# Altium schematic sheet Matrice.SchDoc
size Letter; Organization: Cegep Limoilou; Address1: 1300, 8e Avenue; Address2: Québec, QC; Address3: Canada; Address4: G1J 5L5; Revision: A; SheetNumber: 3; SheetTotal: 6; Conception: Thomas Lajoie; Titre: Matrice de switches; Modification: TL
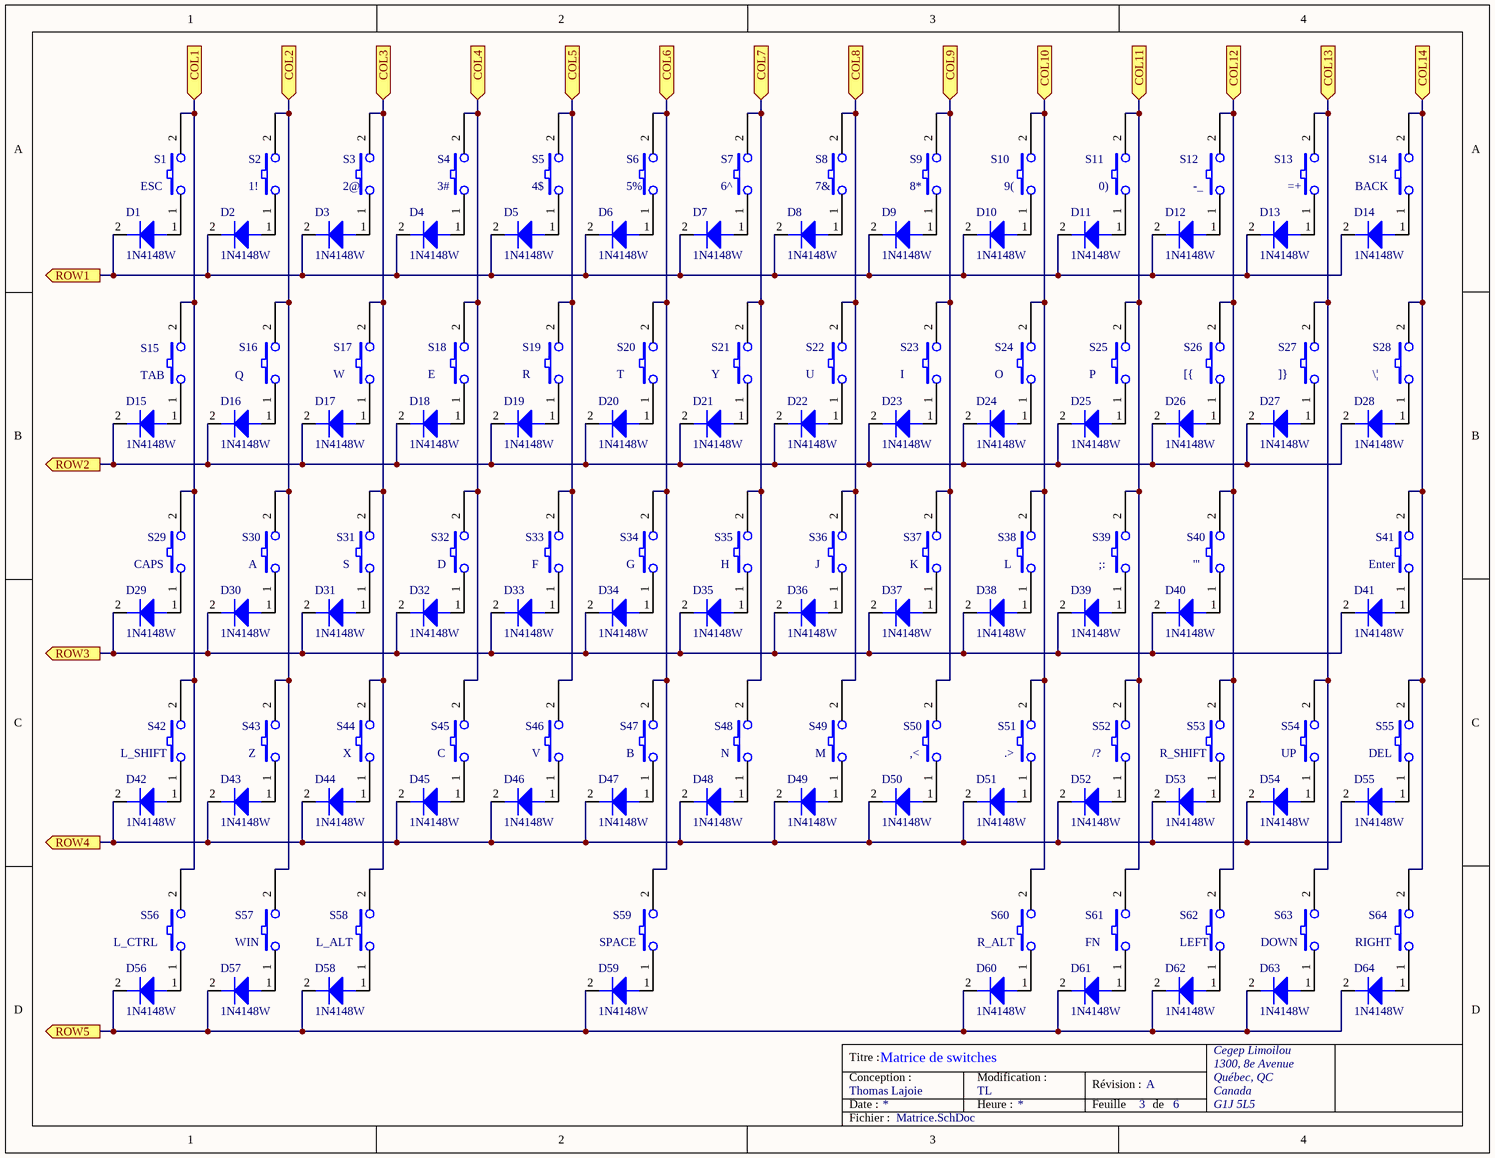
[diagram p0: Matrice.SchDoc]

## Parts
D1  1N4148W  [1N4148W(SOD123)]
D2  1N4148W  [1N4148W(SOD123)]
D3  1N4148W  [1N4148W(SOD123)]
D4  1N4148W  [1N4148W(SOD123)]
D5  1N4148W  [1N4148W(SOD123)]
D6  1N4148W  [1N4148W(SOD123)]
D7  1N4148W  [1N4148W(SOD123)]
D8  1N4148W  [1N4148W(SOD123)]
D9  1N4148W  [1N4148W(SOD123)]
D10  1N4148W  [1N4148W(SOD123)]
D11  1N4148W  [1N4148W(SOD123)]
D12  1N4148W  [1N4148W(SOD123)]
D13  1N4148W  [1N4148W(SOD123)]
D14  1N4148W  [1N4148W(SOD123)]
D15  1N4148W  [1N4148W(SOD123)]
D16  1N4148W  [1N4148W(SOD123)]
D17  1N4148W  [1N4148W(SOD123)]
D18  1N4148W  [1N4148W(SOD123)]
D19  1N4148W  [1N4148W(SOD123)]
D20  1N4148W  [1N4148W(SOD123)]
D21  1N4148W  [1N4148W(SOD123)]
D22  1N4148W  [1N4148W(SOD123)]
D23  1N4148W  [1N4148W(SOD123)]
D24  1N4148W  [1N4148W(SOD123)]
D25  1N4148W  [1N4148W(SOD123)]
D26  1N4148W  [1N4148W(SOD123)]
D27  1N4148W  [1N4148W(SOD123)]
D28  1N4148W  [1N4148W(SOD123)]
D29  1N4148W  [1N4148W(SOD123)]
D30  1N4148W  [1N4148W(SOD123)]
D31  1N4148W  [1N4148W(SOD123)]
D32  1N4148W  [1N4148W(SOD123)]
D33  1N4148W  [1N4148W(SOD123)]
D34  1N4148W  [1N4148W(SOD123)]
D35  1N4148W  [1N4148W(SOD123)]
D36  1N4148W  [1N4148W(SOD123)]
D37  1N4148W  [1N4148W(SOD123)]
D38  1N4148W  [1N4148W(SOD123)]
D39  1N4148W  [1N4148W(SOD123)]
D40  1N4148W  [1N4148W(SOD123)]
D41  1N4148W  [1N4148W(SOD123)]
D42  1N4148W  [1N4148W(SOD123)]
D43  1N4148W  [1N4148W(SOD123)]
D44  1N4148W  [1N4148W(SOD123)]
D45  1N4148W  [1N4148W(SOD123)]
D46  1N4148W  [1N4148W(SOD123)]
D47  1N4148W  [1N4148W(SOD123)]
D48  1N4148W  [1N4148W(SOD123)]
D49  1N4148W  [1N4148W(SOD123)]
D50  1N4148W  [1N4148W(SOD123)]
D51  1N4148W  [1N4148W(SOD123)]
D52  1N4148W  [1N4148W(SOD123)]
D53  1N4148W  [1N4148W(SOD123)]
D54  1N4148W  [1N4148W(SOD123)]
D55  1N4148W  [1N4148W(SOD123)]
D56  1N4148W  [1N4148W(SOD123)]
D57  1N4148W  [1N4148W(SOD123)]
D58  1N4148W  [1N4148W(SOD123)]
D59  1N4148W  [1N4148W(SOD123)]
D60  1N4148W  [1N4148W(SOD123)]
D61  1N4148W  [1N4148W(SOD123)]
D62  1N4148W  [1N4148W(SOD123)]
D63  1N4148W  [1N4148W(SOD123)]
D64  1N4148W  [1N4148W(SOD123)]
S1  ESC  [GATERON_LOWPROFILE_HOTSWAP_SOCKET]
S2  1!  [GATERON_LOWPROFILE_HOTSWAP_SOCKET]
S3  2@  [GATERON_LOWPROFILE_HOTSWAP_SOCKET]
S4  3#  [GATERON_LOWPROFILE_HOTSWAP_SOCKET]
S5  4$  [GATERON_LOWPROFILE_HOTSWAP_SOCKET]
S6  5%  [GATERON_LOWPROFILE_HOTSWAP_SOCKET]
S7  6^  [GATERON_LOWPROFILE_HOTSWAP_SOCKET]
S8  7&  [GATERON_LOWPROFILE_HOTSWAP_SOCKET]
S9  8*  [GATERON_LOWPROFILE_HOTSWAP_SOCKET]
S10  9(  [GATERON_LOWPROFILE_HOTSWAP_SOCKET]
S11  0)  [GATERON_LOWPROFILE_HOTSWAP_SOCKET]
S12  -_  [GATERON_LOWPROFILE_HOTSWAP_SOCKET]
S13  (no value)  [GATERON_LOWPROFILE_HOTSWAP_SOCKET]
S14  BACK  [GATERON_LOWPROFILE_HOTSWAP_SOCKET]
S15  TAB  [GATERON_LOWPROFILE_HOTSWAP_SOCKET]
S16  Q  [GATERON_LOWPROFILE_HOTSWAP_SOCKET]
S17  W  [GATERON_LOWPROFILE_HOTSWAP_SOCKET]
S18  E  [GATERON_LOWPROFILE_HOTSWAP_SOCKET]
S19  R  [GATERON_LOWPROFILE_HOTSWAP_SOCKET]
S20  T  [GATERON_LOWPROFILE_HOTSWAP_SOCKET]
S21  Y  [GATERON_LOWPROFILE_HOTSWAP_SOCKET]
S22  U  [GATERON_LOWPROFILE_HOTSWAP_SOCKET]
S23  I  [GATERON_LOWPROFILE_HOTSWAP_SOCKET]
S24  O  [GATERON_LOWPROFILE_HOTSWAP_SOCKET]
S25  P  [GATERON_LOWPROFILE_HOTSWAP_SOCKET]
S26  [{  [GATERON_LOWPROFILE_HOTSWAP_SOCKET]
S27  ]}  [GATERON_LOWPROFILE_HOTSWAP_SOCKET]
S28  \|  [GATERON_LOWPROFILE_HOTSWAP_SOCKET]
S29  CAPS  [GATERON_LOWPROFILE_HOTSWAP_SOCKET]
S30  A  [GATERON_LOWPROFILE_HOTSWAP_SOCKET]
S31  S  [GATERON_LOWPROFILE_HOTSWAP_SOCKET]
S32  D  [GATERON_LOWPROFILE_HOTSWAP_SOCKET]
S33  F  [GATERON_LOWPROFILE_HOTSWAP_SOCKET]
S34  G  [GATERON_LOWPROFILE_HOTSWAP_SOCKET]
S35  H  [GATERON_LOWPROFILE_HOTSWAP_SOCKET]
S36  J  [GATERON_LOWPROFILE_HOTSWAP_SOCKET]
S37  K  [GATERON_LOWPROFILE_HOTSWAP_SOCKET]
S38  L  [GATERON_LOWPROFILE_HOTSWAP_SOCKET]
S39  ;:  [GATERON_LOWPROFILE_HOTSWAP_SOCKET]
S40  '"  [GATERON_LOWPROFILE_HOTSWAP_SOCKET]
S41  Enter  [GATERON_LOWPROFILE_HOTSWAP_SOCKET]
S42  L_SHIFT  [GATERON_LOWPROFILE_HOTSWAP_SOCKET]
S43  Z  [GATERON_LOWPROFILE_HOTSWAP_SOCKET]
S44  X  [GATERON_LOWPROFILE_HOTSWAP_SOCKET]
S45  C  [GATERON_LOWPROFILE_HOTSWAP_SOCKET]
S46  V  [GATERON_LOWPROFILE_HOTSWAP_SOCKET]
S47  B  [GATERON_LOWPROFILE_HOTSWAP_SOCKET]
S48  N  [GATERON_LOWPROFILE_HOTSWAP_SOCKET]
S49  M  [GATERON_LOWPROFILE_HOTSWAP_SOCKET]
S50  ,<  [GATERON_LOWPROFILE_HOTSWAP_SOCKET]
S51  .>  [GATERON_LOWPROFILE_HOTSWAP_SOCKET]
S52  /?  [GATERON_LOWPROFILE_HOTSWAP_SOCKET]
S53  R_SHIFT  [GATERON_LOWPROFILE_HOTSWAP_SOCKET]
S54  UP  [GATERON_LOWPROFILE_HOTSWAP_SOCKET]
S55  DEL  [GATERON_LOWPROFILE_HOTSWAP_SOCKET]
S56  L_CTRL  [GATERON_LOWPROFILE_HOTSWAP_SOCKET]
S57  WIN  [GATERON_LOWPROFILE_HOTSWAP_SOCKET]
S58  L_ALT  [GATERON_LOWPROFILE_HOTSWAP_SOCKET]
S59  SPACE  [GATERON_LOWPROFILE_HOTSWAP_SOCKET]
S60  R_ALT  [GATERON_LOWPROFILE_HOTSWAP_SOCKET]
S61  FN  [GATERON_LOWPROFILE_HOTSWAP_SOCKET]
S62  LEFT  [GATERON_LOWPROFILE_HOTSWAP_SOCKET]
S63  DOWN  [GATERON_LOWPROFILE_HOTSWAP_SOCKET]
S64  RIGHT  [GATERON_LOWPROFILE_HOTSWAP_SOCKET]

## Ports
COL1 (in), COL2 (in), COL3 (in), COL4 (in), COL5 (in), COL6 (in), COL7 (in), COL8 (in), COL9 (in), COL10 (in), COL11 (in), COL12 (in), COL13 (in), COL14 (in), ROW1 (out), ROW2 (out), ROW3 (out), ROW4 (out), ROW5 (out)

## Nets
COL1: S1.2 S15.2 S29.2 S42.2 S56.2 ; port COL1
COL2: S2.2 S16.2 S30.2 S43.2 S57.2 ; port COL2
COL3: S3.2 S17.2 S31.2 S44.2 S58.2 ; port COL3
COL4: S4.2 S18.2 S32.2 S45.2 ; port COL4
COL5: S5.2 S19.2 S33.2 S46.2 ; port COL5
COL6: S6.2 S20.2 S34.2 S47.2 S59.2 ; port COL6
COL7: S7.2 S21.2 S35.2 S48.2 ; port COL7
COL8: S8.2 S22.2 S36.2 S49.2 ; port COL8
COL9: S9.2 S23.2 S37.2 S50.2 ; port COL9
COL10: S10.2 S24.2 S38.2 S51.2 S60.2 ; port COL10
COL11: S11.2 S25.2 S39.2 S52.2 S61.2 ; port COL11
COL12: S12.2 S26.2 S40.2 S53.2 S62.2 ; port COL12
COL13: S13.2 S27.2 S54.2 S63.2 ; port COL13
COL14: S14.2 S28.2 S41.2 S55.2 S64.2 ; port COL14
ROW1: D1.2(CATHODE) D2.2(CATHODE) D3.2(CATHODE) D4.2(CATHODE) D5.2(CATHODE) D6.2(CATHODE) D7.2(CATHODE) D8.2(CATHODE) D9.2(CATHODE) D10.2(CATHODE) D11.2(CATHODE) D12.2(CATHODE) D13.2(CATHODE) D14.2(CATHODE) ; port ROW1
ROW2: D15.2(CATHODE) D16.2(CATHODE) D17.2(CATHODE) D18.2(CATHODE) D19.2(CATHODE) D20.2(CATHODE) D21.2(CATHODE) D22.2(CATHODE) D23.2(CATHODE) D24.2(CATHODE) D25.2(CATHODE) D26.2(CATHODE) D27.2(CATHODE) D28.2(CATHODE) ; port ROW2
ROW3: D29.2(CATHODE) D30.2(CATHODE) D31.2(CATHODE) D32.2(CATHODE) D33.2(CATHODE) D34.2(CATHODE) D35.2(CATHODE) D36.2(CATHODE) D37.2(CATHODE) D38.2(CATHODE) D39.2(CATHODE) D40.2(CATHODE) D41.2(CATHODE) ; port ROW3
ROW4: D42.2(CATHODE) D43.2(CATHODE) D44.2(CATHODE) D45.2(CATHODE) D46.2(CATHODE) D47.2(CATHODE) D48.2(CATHODE) D49.2(CATHODE) D50.2(CATHODE) D51.2(CATHODE) D52.2(CATHODE) D53.2(CATHODE) D54.2(CATHODE) D55.2(CATHODE) ; port ROW4
ROW5: D56.2(CATHODE) D57.2(CATHODE) D58.2(CATHODE) D59.2(CATHODE) D60.2(CATHODE) D61.2(CATHODE) D62.2(CATHODE) D63.2(CATHODE) D64.2(CATHODE) ; port ROW5
NetD1_1: D1.1(ANODE) S1.1
NetD2_1: D2.1(ANODE) S2.1
NetD3_1: D3.1(ANODE) S3.1
NetD4_1: D4.1(ANODE) S4.1
NetD5_1: D5.1(ANODE) S5.1
NetD6_1: D6.1(ANODE) S6.1
NetD7_1: D7.1(ANODE) S7.1
NetD8_1: D8.1(ANODE) S8.1
NetD9_1: D9.1(ANODE) S9.1
NetD10_1: D10.1(ANODE) S10.1
NetD11_1: D11.1(ANODE) S11.1
NetD12_1: D12.1(ANODE) S12.1
NetD13_1: D13.1(ANODE) S13.1
NetD14_1: D14.1(ANODE) S14.1
NetD15_1: D15.1(ANODE) S15.1
NetD16_1: D16.1(ANODE) S16.1
NetD17_1: D17.1(ANODE) S17.1
NetD18_1: D18.1(ANODE) S18.1
NetD19_1: D19.1(ANODE) S19.1
NetD20_1: D20.1(ANODE) S20.1
NetD21_1: D21.1(ANODE) S21.1
NetD22_1: D22.1(ANODE) S22.1
NetD23_1: D23.1(ANODE) S23.1
NetD24_1: D24.1(ANODE) S24.1
NetD25_1: D25.1(ANODE) S25.1
NetD26_1: D26.1(ANODE) S26.1
NetD27_1: D27.1(ANODE) S27.1
NetD28_1: D28.1(ANODE) S28.1
NetD29_1: D29.1(ANODE) S29.1
NetD30_1: D30.1(ANODE) S30.1
NetD31_1: D31.1(ANODE) S31.1
NetD32_1: D32.1(ANODE) S32.1
NetD33_1: D33.1(ANODE) S33.1
NetD34_1: D34.1(ANODE) S34.1
NetD35_1: D35.1(ANODE) S35.1
NetD36_1: D36.1(ANODE) S36.1
NetD37_1: D37.1(ANODE) S37.1
NetD38_1: D38.1(ANODE) S38.1
NetD39_1: D39.1(ANODE) S39.1
NetD40_1: D40.1(ANODE) S40.1
NetD41_1: D41.1(ANODE) S41.1
NetD42_1: D42.1(ANODE) S42.1
NetD43_1: D43.1(ANODE) S43.1
NetD44_1: D44.1(ANODE) S44.1
NetD45_1: D45.1(ANODE) S45.1
NetD46_1: D46.1(ANODE) S46.1
NetD47_1: D47.1(ANODE) S47.1
NetD48_1: D48.1(ANODE) S48.1
NetD49_1: D49.1(ANODE) S49.1
NetD50_1: D50.1(ANODE) S50.1
NetD51_1: D51.1(ANODE) S51.1
NetD52_1: D52.1(ANODE) S52.1
NetD53_1: D53.1(ANODE) S53.1
NetD54_1: D54.1(ANODE) S54.1
NetD55_1: D55.1(ANODE) S55.1
NetD56_1: D56.1(ANODE) S56.1
NetD57_1: D57.1(ANODE) S57.1
NetD58_1: D58.1(ANODE) S58.1
NetD59_1: D59.1(ANODE) S59.1
NetD60_1: D60.1(ANODE) S60.1
NetD61_1: D61.1(ANODE) S61.1
NetD62_1: D62.1(ANODE) S62.1
NetD63_1: D63.1(ANODE) S63.1
NetD64_1: D64.1(ANODE) S64.1

## Notes on the sheet
- Titre :
- Conception :
- Date :
- Modification :
- Heure :
- Révision :
- Feuille
- de
- Fichier :

## Library data of the parts
D1-D64 = DIODE: LCSC Part #: C2099
S1-S64 = SW PUSHBUTTON